# Altium schematic sheet Sheet1.SchDoc
size A4 portrait; SheetNumber: 1; SheetTotal: 1
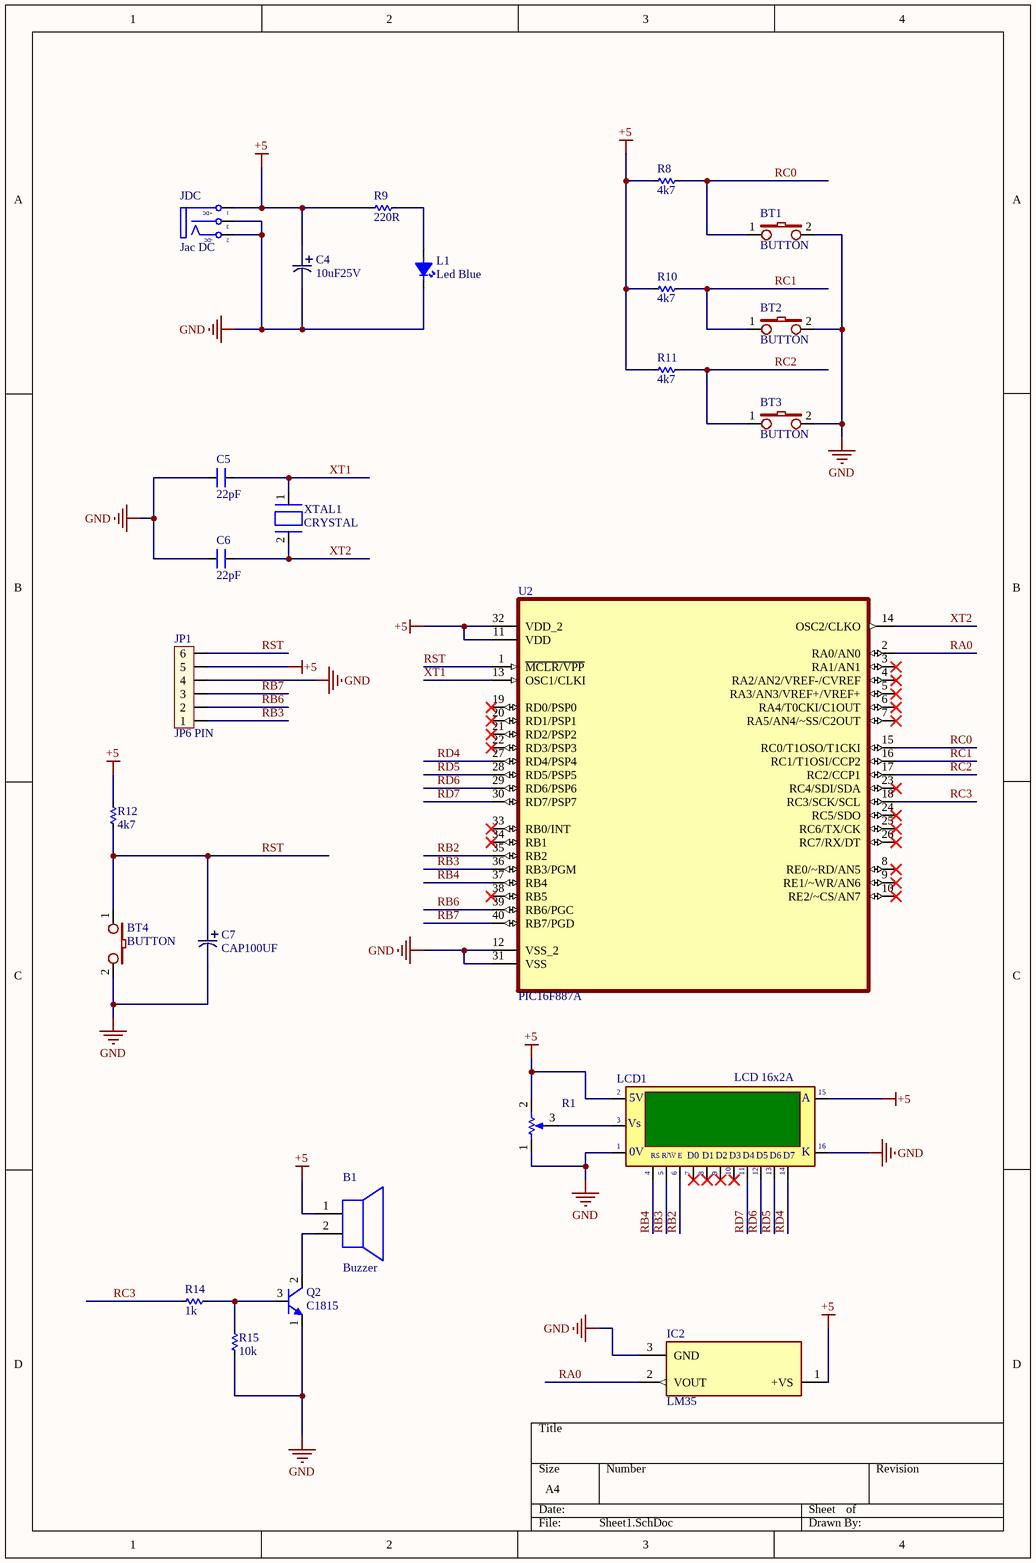
[diagram p0: Sheet1.SchDoc]

## Parts
B1  Buzzer  [Buzzer]
BT1  BUTTON  [BUTTON]
BT2  BUTTON  [BUTTON]
BT3  BUTTON  [BUTTON]
BT4  BUTTON  [BUTTON]
C4  10uF25V  [CAP10UF25V]
C5  22pF  [CN4 5MMP]
C6  22pF  [CN4 5MMP]
C7  CAP100UF  [CAP 100UF 16V]
IC2  LM35  [LM35]
JDC  Jac DC  [DC-IN]
JP1  JP6 PIN  [JP_6PIN]
L1  Led Blue  [Led__Blue_t/h_5mm]
LCD1  LCD 16x2A  [LCD1602]
Q2  C1815  [2SC1815]
R1  POT - cuc ao  [POT - cuc ao 10k]  (value not drawn)
R8  4k7  [R025W_AX04]
R9  220R  [R025W_AX04]
R10  4k7  [R025W_AX04]
R11  4k7  [R025W_AX04]
R12  4k7  [R025W_AX04]
R14  1k  [R025W_AX04]
R15  10k  [R025W_AX04]
U2  PIC16F887A  [PIC16F877A]
XTAL1  CRYSTAL  [Crystal]

## Nets
+5: B1.1(+) C4.1 IC2.1(+VS) JDC.1(T) JP1.5 LCD1.2(VDD) LCD1.15(A) R1.2(BOT) R8.1 R9.2 R10.1 R11.1 R12.1 U2.11(VDD) U2.32(VDD_2)
GND: BT1.2 BT2.2 BT3.2 BT4.2 C4.2 C5.2 C6.1 C7.2 IC2.3(GND) JDC.2(TN) JDC.3(S) JP1.4 L1.2(K) LCD1.1(GND) LCD1.16(K) Q2.1(E) R1.1(TOP) R15.1 U2.12(VSS_2) U2.31(VSS)
RA0: IC2.2(VOUT) U2.2(RA0/AN0)
RB2: LCD1.6(~{EN}) U2.35(RB2)
RB3: JP1.1 LCD1.5(R/~{W}) U2.36(RB3/PGM)
RB4: LCD1.4(RS) U2.37(RB4)
RB6: JP1.2 U2.39(RB6/PGC)
RB7: JP1.3 U2.40(RB7/PGD)
RC0: BT1.1 R8.2 U2.15(RC0/T1OSO/T1CKI)
RC1: BT2.1 R10.2 U2.16(RC1/T1OSI/CCP2)
RC2: BT3.1 R11.2 U2.17(RC2/CCP1)
RC3: R14.1 U2.18(RC3/SCK/SCL)
RD4: LCD1.14(D7) U2.27(RD4/PSP4)
RD5: LCD1.13(D6) U2.28(RD5/PSP5)
RD6: LCD1.12(D5) U2.29(RD6/PSP6)
RD7: LCD1.11(D4) U2.30(RD7/PSP7)
RST: BT4.1 C7.1 JP1.6 R12.2 U2.1(~{MCLR/VPP})
XT1: C5.1 U2.13(OSC1/CLKI) XTAL1.1
XT2: C6.2 U2.14(OSC2/CLKO) XTAL1.2
NetB1_2: B1.2(-) Q2.2(C)
NetL1_1: L1.1(A) R9.1
NetLCD1_3: LCD1.3(VEE) R1.3(TAP)
NetQ2_3: Q2.3(B) R14.2 R15.2

Not connected (* = marked no-connect by the designer): LCD1 7(D0)* 8(D1)* 9(D2)* 10(D3)*; U2 3(RA1/AN1)* 4(RA2/AN2/VREF-/CVREF)* 5(RA3/AN3/VREF+/VREF+)* 6(RA4/T0CKI/C1OUT)* 7(RA5/AN4/~SS/C2OUT)* 8(RE0/~RD/AN5)* 9(RE1/~WR/AN6)* 10(RE2/~CS/AN7)* 19(RD0/PSP0)* 20(RD1/PSP1)* 21(RD2/PSP2)* 22(RD3/PSP3)* 23(RC4/SDI/SDA)* 24(RC5/SDO)* 25(RC6/TX/CK)* 26(RC7/RX/DT)* 33(RB0/INT)* 34(RB1)* 38(RB5)*

## Notes on the sheet
- (in symbol DCIN) +DC; -DC
- (in symbol LCD16x2A) 5V; Vs; |; 0V; R/W; E

## Library data of the parts
C4 = CAP 10UF25V: CAP 10UF 25V 4W7H2P
C5 C6 = CAP CERAMIC
C7 = CAP100UF16V: CAP100UF 16V 2P
JDC = DCIN: Jac DC input; Value: Jac DC
JP1 = JP6: Value: JP7
LCD1 = LCD16x2A: LCD dipslay 16 char, 2 line; Value: LCD16x2A
Q2 = TRANS_NPN_C1815: Trans NPN 50V 150mA TO-92; ComponentLink1Description: Datasheet; ComponentLink1URL: D:\Dropbox\Datasheets\Transistors\P Channel Bipolar\2SC1815.pdf; Unit Price: 0.0143
R1 = POT - cuc ao: 10k
R8-R12 R14 R15 = Res: Manufacturer: Generic Components; Class: Passive; SubClass: R; Published: 08/06/2000; Publisher: Altium Hobart Technology Centre
U2 = PIC16F887A: PIC PIC16F Microcontroller IC 8-Bit 20MHz 14KB (8K x 14) FLASH 44-TQFP (10x10)